# Altium project TestBoard_01.PrjPcb
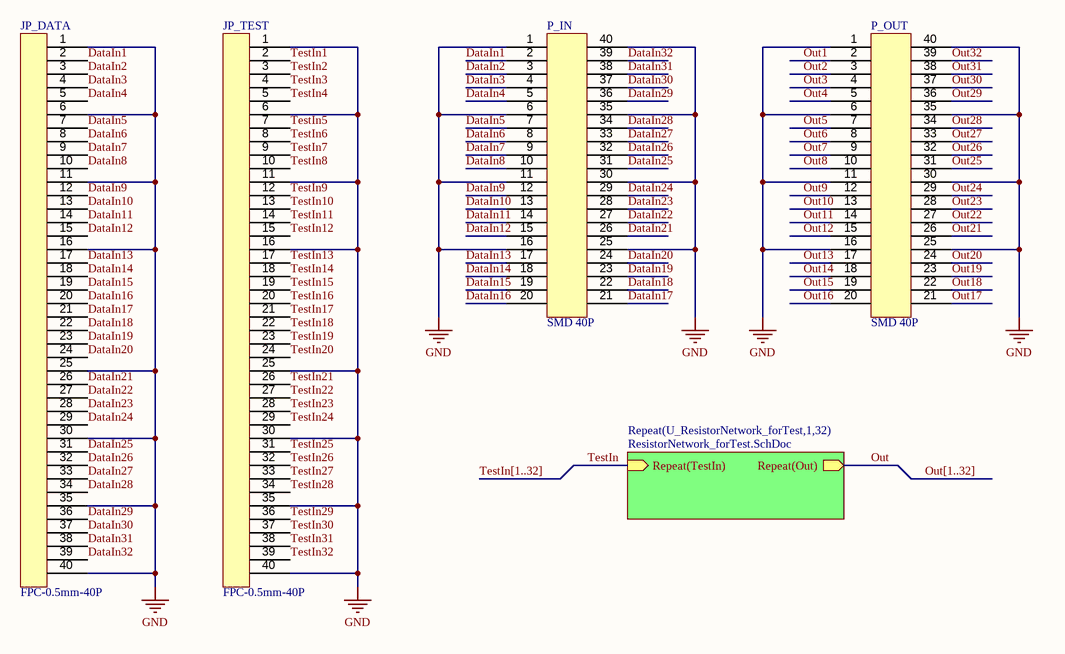
[diagram p0: TestBoard.SchDoc]
Version: 1.1 (TO); RepoURL: https://github.com/hkust-fiona/fiona-hardware.git; Project: FIONA Toolchain (Test Board #01); License: Light the Way Forward; Author: Yinyi (Shannon) LIU
2 sheets, 100 parts. Net scope: hierarchical (ports join the sheet entries above them; power ports are global).
Board file: PCB_TestBoard.PcbDoc
Sheets:
  TestBoard.SchDoc
    U_ResistorNetwork_forTest1 = ResistorNetwork_forTest.SchDoc
    U_ResistorNetwork_forTest2 = ResistorNetwork_forTest.SchDoc
    U_ResistorNetwork_forTest3 = ResistorNetwork_forTest.SchDoc
    U_ResistorNetwork_forTest4 = ResistorNetwork_forTest.SchDoc
    U_ResistorNetwork_forTest5 = ResistorNetwork_forTest.SchDoc
    U_ResistorNetwork_forTest6 = ResistorNetwork_forTest.SchDoc
    U_ResistorNetwork_forTest7 = ResistorNetwork_forTest.SchDoc
    U_ResistorNetwork_forTest8 = ResistorNetwork_forTest.SchDoc
    U_ResistorNetwork_forTest9 = ResistorNetwork_forTest.SchDoc
    U_ResistorNetwork_forTest10 = ResistorNetwork_forTest.SchDoc
    U_ResistorNetwork_forTest11 = ResistorNetwork_forTest.SchDoc
    U_ResistorNetwork_forTest12 = ResistorNetwork_forTest.SchDoc
    U_ResistorNetwork_forTest13 = ResistorNetwork_forTest.SchDoc
    U_ResistorNetwork_forTest14 = ResistorNetwork_forTest.SchDoc
    U_ResistorNetwork_forTest15 = ResistorNetwork_forTest.SchDoc
    U_ResistorNetwork_forTest16 = ResistorNetwork_forTest.SchDoc
    U_ResistorNetwork_forTest17 = ResistorNetwork_forTest.SchDoc
    U_ResistorNetwork_forTest18 = ResistorNetwork_forTest.SchDoc
    U_ResistorNetwork_forTest19 = ResistorNetwork_forTest.SchDoc
    U_ResistorNetwork_forTest20 = ResistorNetwork_forTest.SchDoc
    U_ResistorNetwork_forTest21 = ResistorNetwork_forTest.SchDoc
    U_ResistorNetwork_forTest22 = ResistorNetwork_forTest.SchDoc
    U_ResistorNetwork_forTest23 = ResistorNetwork_forTest.SchDoc
    U_ResistorNetwork_forTest24 = ResistorNetwork_forTest.SchDoc
    U_ResistorNetwork_forTest25 = ResistorNetwork_forTest.SchDoc
    U_ResistorNetwork_forTest26 = ResistorNetwork_forTest.SchDoc
    U_ResistorNetwork_forTest27 = ResistorNetwork_forTest.SchDoc
    U_ResistorNetwork_forTest28 = ResistorNetwork_forTest.SchDoc
    U_ResistorNetwork_forTest29 = ResistorNetwork_forTest.SchDoc
    U_ResistorNetwork_forTest30 = ResistorNetwork_forTest.SchDoc
    U_ResistorNetwork_forTest31 = ResistorNetwork_forTest.SchDoc
    U_ResistorNetwork_forTest32 = ResistorNetwork_forTest.SchDoc

## Sheet TestBoard.SchDoc: Tray Board for Photonic Chip
size A4; Date: Mar 22, 2023; Author: Yinyi (Shannon) LIU; SheetNumber: 1; SheetTotal: 2

### Parts
JP_DATA  FPC-0.5mm-40P  [FPC0.5 2H-WS-40P]
JP_TEST  FPC-0.5mm-40P  [FPC0.5 2H-WS-40P]
P_IN  SMD 40P  [SMD-40P-W0.2-H0.6-T0.4]
P_OUT  SMD 40P  [SMD-40P-W0.2-H0.6-T0.4]

### Sub-sheets
Repeat(U_ResistorNetwork_forTest,1,32) = ResistorNetwork_forTest.SchDoc: Repeat(TestIn) (in), Repeat(Out) (out)

### Nets
GND: JP_DATA.1 JP_DATA.6 JP_DATA.11 JP_DATA.16 JP_DATA.25 JP_DATA.30 JP_DATA.35 JP_DATA.40 JP_TEST.1 JP_TEST.6 JP_TEST.11 JP_TEST.16 JP_TEST.25 JP_TEST.30 JP_TEST.35 JP_TEST.40 P_IN.1 P_IN.6 P_IN.11 P_IN.16 P_IN.25 P_IN.30 P_IN.35 P_IN.40 P_OUT.1 P_OUT.6 P_OUT.11 P_OUT.16 P_OUT.25 P_OUT.30 P_OUT.35 P_OUT.40
DataIn1: JP_DATA.2 P_IN.2
DataIn2: JP_DATA.3 P_IN.3
DataIn3: JP_DATA.4 P_IN.4
DataIn4: JP_DATA.5 P_IN.5
DataIn5: JP_DATA.7 P_IN.7
DataIn6: JP_DATA.8 P_IN.8
DataIn7: JP_DATA.9 P_IN.9
DataIn8: JP_DATA.10 P_IN.10
DataIn9: JP_DATA.12 P_IN.12
DataIn10: JP_DATA.13 P_IN.13
DataIn11: JP_DATA.14 P_IN.14
DataIn12: JP_DATA.15 P_IN.15
DataIn13: JP_DATA.17 P_IN.17
DataIn14: JP_DATA.18 P_IN.18
DataIn15: JP_DATA.19 P_IN.19
DataIn16: JP_DATA.20 P_IN.20
DataIn17: JP_DATA.21 P_IN.21
DataIn18: JP_DATA.22 P_IN.22
DataIn19: JP_DATA.23 P_IN.23
DataIn20: JP_DATA.24 P_IN.24
DataIn21: JP_DATA.26 P_IN.26
DataIn22: JP_DATA.27 P_IN.27
DataIn23: JP_DATA.28 P_IN.28
DataIn24: JP_DATA.29 P_IN.29
DataIn25: JP_DATA.31 P_IN.31
DataIn26: JP_DATA.32 P_IN.32
DataIn27: JP_DATA.33 P_IN.33
DataIn28: JP_DATA.34 P_IN.34
DataIn29: JP_DATA.36 P_IN.36
DataIn30: JP_DATA.37 P_IN.37
DataIn31: JP_DATA.38 P_IN.38
DataIn32: JP_DATA.39 P_IN.39
Out: sheet Repeat(U_ResistorNetwork_forTest,1,32)/Repeat(Out)
Out1: P_OUT.2
Out2: P_OUT.3
Out3: P_OUT.4
Out4: P_OUT.5
Out5: P_OUT.7
Out6: P_OUT.8
Out7: P_OUT.9
Out8: P_OUT.10
Out9: P_OUT.12
Out10: P_OUT.13
Out11: P_OUT.14
Out12: P_OUT.15
Out13: P_OUT.17
Out14: P_OUT.18
Out15: P_OUT.19
Out16: P_OUT.20
Out17: P_OUT.21
Out18: P_OUT.22
Out19: P_OUT.23
Out20: P_OUT.24
Out21: P_OUT.26
Out22: P_OUT.27
Out23: P_OUT.28
Out24: P_OUT.29
Out25: P_OUT.31
Out26: P_OUT.32
Out27: P_OUT.33
Out28: P_OUT.34
Out29: P_OUT.36
Out30: P_OUT.37
Out31: P_OUT.38
Out32: P_OUT.39
TestIn: sheet Repeat(U_ResistorNetwork_forTest,1,32)/Repeat(TestIn)
TestIn1: JP_TEST.2
TestIn2: JP_TEST.3
TestIn3: JP_TEST.4
TestIn4: JP_TEST.5
TestIn5: JP_TEST.7
TestIn6: JP_TEST.8
TestIn7: JP_TEST.9
TestIn8: JP_TEST.10
TestIn9: JP_TEST.12
TestIn10: JP_TEST.13
TestIn11: JP_TEST.14
TestIn12: JP_TEST.15
TestIn13: JP_TEST.17
TestIn14: JP_TEST.18
TestIn15: JP_TEST.19
TestIn16: JP_TEST.20
TestIn17: JP_TEST.21
TestIn18: JP_TEST.22
TestIn19: JP_TEST.23
TestIn20: JP_TEST.24
TestIn21: JP_TEST.26
TestIn22: JP_TEST.27
TestIn23: JP_TEST.28
TestIn24: JP_TEST.29
TestIn25: JP_TEST.31
TestIn26: JP_TEST.32
TestIn27: JP_TEST.33
TestIn28: JP_TEST.34
TestIn29: JP_TEST.36
TestIn30: JP_TEST.37
TestIn31: JP_TEST.38
TestIn32: JP_TEST.39

### Buses and harness runs
bus Out[1..32]
bus TestIn[1..32]

### Notes on the sheet
- Title
- FileName:
- Version:
- Date:
- Project
- Designed By:
- Descriptions:
- Sheet:
- of

### Library data of the parts
JP_DATA JP_TEST = FPC-0.5mm-40P: FPC Connector 0.5mm 40PIN
P_IN P_OUT = SMD 40P: SMD Pad for Chip Bonding (40 PIN).

## Sheet ResistorNetwork_forTest.SchDoc: Resistor Network as Voltage Divider for Testing
size A4; Date: Mar 22, 2023; SheetNumber: 2; SheetTotal: 2
Used 32 times, as channels U_ResistorNetwork_forTest1, U_ResistorNetwork_forTest2, U_ResistorNetwork_forTest3, U_ResistorNetwork_forTest4, U_ResistorNetwork_forTest5, U_ResistorNetwork_forTest6, U_ResistorNetwork_forTest7, U_ResistorNetwork_forTest8, U_ResistorNetwork_forTest9, U_ResistorNetwork_forTest10, U_ResistorNetwork_forTest11, U_ResistorNetwork_forTest12, U_ResistorNetwork_forTest13, U_ResistorNetwork_forTest14, U_ResistorNetwork_forTest15, U_ResistorNetwork_forTest16, U_ResistorNetwork_forTest17, U_ResistorNetwork_forTest18, U_ResistorNetwork_forTest19, U_ResistorNetwork_forTest20, U_ResistorNetwork_forTest21, U_ResistorNetwork_forTest22, U_ResistorNetwork_forTest23, U_ResistorNetwork_forTest24, U_ResistorNetwork_forTest25, U_ResistorNetwork_forTest26, U_ResistorNetwork_forTest27, U_ResistorNetwork_forTest28, U_ResistorNetwork_forTest29, U_ResistorNetwork_forTest30, U_ResistorNetwork_forTest31, U_ResistorNetwork_forTest32. Parts and nets are listed once, with the designators drawn on the sheet.
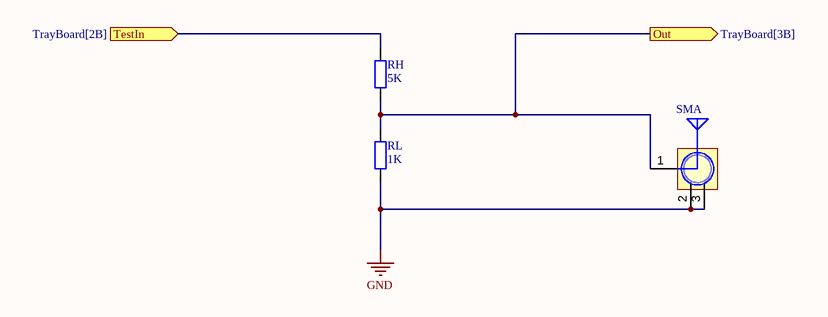
[diagram p1: ResistorNetwork_forTest.SchDoc]

### Parts
RH  5K  [R 0402_L]
RL  1K  [R 0402_L]
SMA  SMA RF 立式  [SMA-KE-LI]  (value not drawn)

### Ports
Out (out, see TrayBoard[3B]), TestIn (in, see TrayBoard[2B])

### Nets
GND: RL.1 SMA.2(GND) SMA.3(GND)
Out: RH.1 RL.2 SMA.1(ANT) ; port Out
TestIn: RH.2 ; port TestIn

### Channels
U_ResistorNetwork_forTest1: designators end in _U_ResistorNetwork_forTest1; ports Out=Out1 TestIn=TestIn1
U_ResistorNetwork_forTest2: designators end in _U_ResistorNetwork_forTest2; ports Out=Out2 TestIn=TestIn2
U_ResistorNetwork_forTest3: designators end in _U_ResistorNetwork_forTest3; ports Out=Out3 TestIn=TestIn3
U_ResistorNetwork_forTest4: designators end in _U_ResistorNetwork_forTest4; ports Out=Out4 TestIn=TestIn4
U_ResistorNetwork_forTest5: designators end in _U_ResistorNetwork_forTest5; ports Out=Out5 TestIn=TestIn5
U_ResistorNetwork_forTest6: designators end in _U_ResistorNetwork_forTest6; ports Out=Out6 TestIn=TestIn6
U_ResistorNetwork_forTest7: designators end in _U_ResistorNetwork_forTest7; ports Out=Out7 TestIn=TestIn7
U_ResistorNetwork_forTest8: designators end in _U_ResistorNetwork_forTest8; ports Out=Out8 TestIn=TestIn8
U_ResistorNetwork_forTest9: designators end in _U_ResistorNetwork_forTest9; ports Out=Out9 TestIn=TestIn9
U_ResistorNetwork_forTest10: designators end in _U_ResistorNetwork_forTest10; ports Out=Out10 TestIn=TestIn10
U_ResistorNetwork_forTest11: designators end in _U_ResistorNetwork_forTest11; ports Out=Out11 TestIn=TestIn11
U_ResistorNetwork_forTest12: designators end in _U_ResistorNetwork_forTest12; ports Out=Out12 TestIn=TestIn12
U_ResistorNetwork_forTest13: designators end in _U_ResistorNetwork_forTest13; ports Out=Out13 TestIn=TestIn13
U_ResistorNetwork_forTest14: designators end in _U_ResistorNetwork_forTest14; ports Out=Out14 TestIn=TestIn14
U_ResistorNetwork_forTest15: designators end in _U_ResistorNetwork_forTest15; ports Out=Out15 TestIn=TestIn15
U_ResistorNetwork_forTest16: designators end in _U_ResistorNetwork_forTest16; ports Out=Out16 TestIn=TestIn16
U_ResistorNetwork_forTest17: designators end in _U_ResistorNetwork_forTest17; ports Out=Out17 TestIn=TestIn17
U_ResistorNetwork_forTest18: designators end in _U_ResistorNetwork_forTest18; ports Out=Out18 TestIn=TestIn18
U_ResistorNetwork_forTest19: designators end in _U_ResistorNetwork_forTest19; ports Out=Out19 TestIn=TestIn19
U_ResistorNetwork_forTest20: designators end in _U_ResistorNetwork_forTest20; ports Out=Out20 TestIn=TestIn20
U_ResistorNetwork_forTest21: designators end in _U_ResistorNetwork_forTest21; ports Out=Out21 TestIn=TestIn21
U_ResistorNetwork_forTest22: designators end in _U_ResistorNetwork_forTest22; ports Out=Out22 TestIn=TestIn22
U_ResistorNetwork_forTest23: designators end in _U_ResistorNetwork_forTest23; ports Out=Out23 TestIn=TestIn23
U_ResistorNetwork_forTest24: designators end in _U_ResistorNetwork_forTest24; ports Out=Out24 TestIn=TestIn24
U_ResistorNetwork_forTest25: designators end in _U_ResistorNetwork_forTest25; ports Out=Out25 TestIn=TestIn25
U_ResistorNetwork_forTest26: designators end in _U_ResistorNetwork_forTest26; ports Out=Out26 TestIn=TestIn26
U_ResistorNetwork_forTest27: designators end in _U_ResistorNetwork_forTest27; ports Out=Out27 TestIn=TestIn27
U_ResistorNetwork_forTest28: designators end in _U_ResistorNetwork_forTest28; ports Out=Out28 TestIn=TestIn28
U_ResistorNetwork_forTest29: designators end in _U_ResistorNetwork_forTest29; ports Out=Out29 TestIn=TestIn29
U_ResistorNetwork_forTest30: designators end in _U_ResistorNetwork_forTest30; ports Out=Out30 TestIn=TestIn30
U_ResistorNetwork_forTest31: designators end in _U_ResistorNetwork_forTest31; ports Out=Out31 TestIn=TestIn31
U_ResistorNetwork_forTest32: designators end in _U_ResistorNetwork_forTest32; ports Out=Out32 TestIn=TestIn32

### Notes on the sheet
- Title
- FileName:
- Version:
- Date:
- Project
- Designed By:
- Descriptions:
- Sheet:
- of

### Library data of the parts
RH = R: 贴片电阻 0.1% / C3202451; 版权归属: 来自淘宝 ID：黄晶宝石; 封装库来自淘宝卖家 ID：黄晶宝石: 其他店铺购入均为盗版，不享受售后技术支持服务，请立即申请退款; BOM名称: 贴片电阻; 联系售后: https://shop463601444.taobao.com
RL = R: 贴片电阻 0.1%; 版权归属: 来自淘宝 ID：黄晶宝石; 封装库来自淘宝卖家 ID：黄晶宝石: 其他店铺购入均为盗版，不享受售后技术支持服务，请立即申请退款; BOM名称: 贴片电阻; 联系售后: https://shop463601444.taobao.com
SMA = SMA: BOM名称: SMA-2.4G射频天线接口; 版权归属: 封装库来自淘宝 ID：黄晶宝石; 唯一出售店铺网址: https://shop463601444.taobao.com

## Nets that join several sheets
GND: TestBoard (32 pins), U_ResistorNetwork_forTest1 (RL_U_ResistorNetwork_forTest1.1 SMA_U_ResistorNetwork_forTest1.2 SMA_U_ResistorNetwork_forTest1.3), U_ResistorNetwork_forTest2 (RL_U_ResistorNetwork_forTest2.1 SMA_U_ResistorNetwork_forTest2.2 SMA_U_ResistorNetwork_forTest2.3), U_ResistorNetwork_forTest3 (RL_U_ResistorNetwork_forTest3.1 SMA_U_ResistorNetwork_forTest3.2 SMA_U_ResistorNetwork_forTest3.3), U_ResistorNetwork_forTest4 (RL_U_ResistorNetwork_forTest4.1 SMA_U_ResistorNetwork_forTest4.2 SMA_U_ResistorNetwork_forTest4.3), U_ResistorNetwork_forTest5 (RL_U_ResistorNetwork_forTest5.1 SMA_U_ResistorNetwork_forTest5.2 SMA_U_ResistorNetwork_forTest5.3), U_ResistorNetwork_forTest6 (RL_U_ResistorNetwork_forTest6.1 SMA_U_ResistorNetwork_forTest6.2 SMA_U_ResistorNetwork_forTest6.3), U_ResistorNetwork_forTest7 (RL_U_ResistorNetwork_forTest7.1 SMA_U_ResistorNetwork_forTest7.2 SMA_U_ResistorNetwork_forTest7.3), U_ResistorNetwork_forTest8 (RL_U_ResistorNetwork_forTest8.1 SMA_U_ResistorNetwork_forTest8.2 SMA_U_ResistorNetwork_forTest8.3), U_ResistorNetwork_forTest9 (RL_U_ResistorNetwork_forTest9.1 SMA_U_ResistorNetwork_forTest9.2 SMA_U_ResistorNetwork_forTest9.3), U_ResistorNetwork_forTest10 (RL_U_ResistorNetwork_forTest10.1 SMA_U_ResistorNetwork_forTest10.2 SMA_U_ResistorNetwork_forTest10.3), U_ResistorNetwork_forTest11 (RL_U_ResistorNetwork_forTest11.1 SMA_U_ResistorNetwork_forTest11.2 SMA_U_ResistorNetwork_forTest11.3), U_ResistorNetwork_forTest12 (RL_U_ResistorNetwork_forTest12.1 SMA_U_ResistorNetwork_forTest12.2 SMA_U_ResistorNetwork_forTest12.3), U_ResistorNetwork_forTest13 (RL_U_ResistorNetwork_forTest13.1 SMA_U_ResistorNetwork_forTest13.2 SMA_U_ResistorNetwork_forTest13.3), U_ResistorNetwork_forTest14 (RL_U_ResistorNetwork_forTest14.1 SMA_U_ResistorNetwork_forTest14.2 SMA_U_ResistorNetwork_forTest14.3), U_ResistorNetwork_forTest15 (RL_U_ResistorNetwork_forTest15.1 SMA_U_ResistorNetwork_forTest15.2 SMA_U_ResistorNetwork_forTest15.3), U_ResistorNetwork_forTest16 (RL_U_ResistorNetwork_forTest16.1 SMA_U_ResistorNetwork_forTest16.2 SMA_U_ResistorNetwork_forTest16.3), U_ResistorNetwork_forTest17 (RL_U_ResistorNetwork_forTest17.1 SMA_U_ResistorNetwork_forTest17.2 SMA_U_ResistorNetwork_forTest17.3), U_ResistorNetwork_forTest18 (RL_U_ResistorNetwork_forTest18.1 SMA_U_ResistorNetwork_forTest18.2 SMA_U_ResistorNetwork_forTest18.3), U_ResistorNetwork_forTest19 (RL_U_ResistorNetwork_forTest19.1 SMA_U_ResistorNetwork_forTest19.2 SMA_U_ResistorNetwork_forTest19.3), U_ResistorNetwork_forTest20 (RL_U_ResistorNetwork_forTest20.1 SMA_U_ResistorNetwork_forTest20.2 SMA_U_ResistorNetwork_forTest20.3), U_ResistorNetwork_forTest21 (RL_U_ResistorNetwork_forTest21.1 SMA_U_ResistorNetwork_forTest21.2 SMA_U_ResistorNetwork_forTest21.3), U_ResistorNetwork_forTest22 (RL_U_ResistorNetwork_forTest22.1 SMA_U_ResistorNetwork_forTest22.2 SMA_U_ResistorNetwork_forTest22.3), U_ResistorNetwork_forTest23 (RL_U_ResistorNetwork_forTest23.1 SMA_U_ResistorNetwork_forTest23.2 SMA_U_ResistorNetwork_forTest23.3), U_ResistorNetwork_forTest24 (RL_U_ResistorNetwork_forTest24.1 SMA_U_ResistorNetwork_forTest24.2 SMA_U_ResistorNetwork_forTest24.3), U_ResistorNetwork_forTest25 (RL_U_ResistorNetwork_forTest25.1 SMA_U_ResistorNetwork_forTest25.2 SMA_U_ResistorNetwork_forTest25.3), U_ResistorNetwork_forTest26 (RL_U_ResistorNetwork_forTest26.1 SMA_U_ResistorNetwork_forTest26.2 SMA_U_ResistorNetwork_forTest26.3), U_ResistorNetwork_forTest27 (RL_U_ResistorNetwork_forTest27.1 SMA_U_ResistorNetwork_forTest27.2 SMA_U_ResistorNetwork_forTest27.3), U_ResistorNetwork_forTest28 (RL_U_ResistorNetwork_forTest28.1 SMA_U_ResistorNetwork_forTest28.2 SMA_U_ResistorNetwork_forTest28.3), U_ResistorNetwork_forTest29 (RL_U_ResistorNetwork_forTest29.1 SMA_U_ResistorNetwork_forTest29.2 SMA_U_ResistorNetwork_forTest29.3), U_ResistorNetwork_forTest30 (RL_U_ResistorNetwork_forTest30.1 SMA_U_ResistorNetwork_forTest30.2 SMA_U_ResistorNetwork_forTest30.3), U_ResistorNetwork_forTest31 (RL_U_ResistorNetwork_forTest31.1 SMA_U_ResistorNetwork_forTest31.2 SMA_U_ResistorNetwork_forTest31.3), U_ResistorNetwork_forTest32 (RL_U_ResistorNetwork_forTest32.1 SMA_U_ResistorNetwork_forTest32.2 SMA_U_ResistorNetwork_forTest32.3)
Out1: TestBoard (P_OUT.2), U_ResistorNetwork_forTest1 (RH_U_ResistorNetwork_forTest1.1 RL_U_ResistorNetwork_forTest1.2 SMA_U_ResistorNetwork_forTest1.1)
Out2: TestBoard (P_OUT.3), U_ResistorNetwork_forTest2 (RH_U_ResistorNetwork_forTest2.1 RL_U_ResistorNetwork_forTest2.2 SMA_U_ResistorNetwork_forTest2.1)
Out3: TestBoard (P_OUT.4), U_ResistorNetwork_forTest3 (RH_U_ResistorNetwork_forTest3.1 RL_U_ResistorNetwork_forTest3.2 SMA_U_ResistorNetwork_forTest3.1)
Out4: TestBoard (P_OUT.5), U_ResistorNetwork_forTest4 (RH_U_ResistorNetwork_forTest4.1 RL_U_ResistorNetwork_forTest4.2 SMA_U_ResistorNetwork_forTest4.1)
Out5: TestBoard (P_OUT.7), U_ResistorNetwork_forTest5 (RH_U_ResistorNetwork_forTest5.1 RL_U_ResistorNetwork_forTest5.2 SMA_U_ResistorNetwork_forTest5.1)
Out6: TestBoard (P_OUT.8), U_ResistorNetwork_forTest6 (RH_U_ResistorNetwork_forTest6.1 RL_U_ResistorNetwork_forTest6.2 SMA_U_ResistorNetwork_forTest6.1)
Out7: TestBoard (P_OUT.9), U_ResistorNetwork_forTest7 (RH_U_ResistorNetwork_forTest7.1 RL_U_ResistorNetwork_forTest7.2 SMA_U_ResistorNetwork_forTest7.1)
Out8: TestBoard (P_OUT.10), U_ResistorNetwork_forTest8 (RH_U_ResistorNetwork_forTest8.1 RL_U_ResistorNetwork_forTest8.2 SMA_U_ResistorNetwork_forTest8.1)
Out9: TestBoard (P_OUT.12), U_ResistorNetwork_forTest9 (RH_U_ResistorNetwork_forTest9.1 RL_U_ResistorNetwork_forTest9.2 SMA_U_ResistorNetwork_forTest9.1)
Out10: TestBoard (P_OUT.13), U_ResistorNetwork_forTest10 (RH_U_ResistorNetwork_forTest10.1 RL_U_ResistorNetwork_forTest10.2 SMA_U_ResistorNetwork_forTest10.1)
Out11: TestBoard (P_OUT.14), U_ResistorNetwork_forTest11 (RH_U_ResistorNetwork_forTest11.1 RL_U_ResistorNetwork_forTest11.2 SMA_U_ResistorNetwork_forTest11.1)
Out12: TestBoard (P_OUT.15), U_ResistorNetwork_forTest12 (RH_U_ResistorNetwork_forTest12.1 RL_U_ResistorNetwork_forTest12.2 SMA_U_ResistorNetwork_forTest12.1)
Out13: TestBoard (P_OUT.17), U_ResistorNetwork_forTest13 (RH_U_ResistorNetwork_forTest13.1 RL_U_ResistorNetwork_forTest13.2 SMA_U_ResistorNetwork_forTest13.1)
Out14: TestBoard (P_OUT.18), U_ResistorNetwork_forTest14 (RH_U_ResistorNetwork_forTest14.1 RL_U_ResistorNetwork_forTest14.2 SMA_U_ResistorNetwork_forTest14.1)
Out15: TestBoard (P_OUT.19), U_ResistorNetwork_forTest15 (RH_U_ResistorNetwork_forTest15.1 RL_U_ResistorNetwork_forTest15.2 SMA_U_ResistorNetwork_forTest15.1)
Out16: TestBoard (P_OUT.20), U_ResistorNetwork_forTest16 (RH_U_ResistorNetwork_forTest16.1 RL_U_ResistorNetwork_forTest16.2 SMA_U_ResistorNetwork_forTest16.1)
Out17: TestBoard (P_OUT.21), U_ResistorNetwork_forTest17 (RH_U_ResistorNetwork_forTest17.1 RL_U_ResistorNetwork_forTest17.2 SMA_U_ResistorNetwork_forTest17.1)
Out18: TestBoard (P_OUT.22), U_ResistorNetwork_forTest18 (RH_U_ResistorNetwork_forTest18.1 RL_U_ResistorNetwork_forTest18.2 SMA_U_ResistorNetwork_forTest18.1)
Out19: TestBoard (P_OUT.23), U_ResistorNetwork_forTest19 (RH_U_ResistorNetwork_forTest19.1 RL_U_ResistorNetwork_forTest19.2 SMA_U_ResistorNetwork_forTest19.1)
Out20: TestBoard (P_OUT.24), U_ResistorNetwork_forTest20 (RH_U_ResistorNetwork_forTest20.1 RL_U_ResistorNetwork_forTest20.2 SMA_U_ResistorNetwork_forTest20.1)
Out21: TestBoard (P_OUT.26), U_ResistorNetwork_forTest21 (RH_U_ResistorNetwork_forTest21.1 RL_U_ResistorNetwork_forTest21.2 SMA_U_ResistorNetwork_forTest21.1)
Out22: TestBoard (P_OUT.27), U_ResistorNetwork_forTest22 (RH_U_ResistorNetwork_forTest22.1 RL_U_ResistorNetwork_forTest22.2 SMA_U_ResistorNetwork_forTest22.1)
Out23: TestBoard (P_OUT.28), U_ResistorNetwork_forTest23 (RH_U_ResistorNetwork_forTest23.1 RL_U_ResistorNetwork_forTest23.2 SMA_U_ResistorNetwork_forTest23.1)
Out24: TestBoard (P_OUT.29), U_ResistorNetwork_forTest24 (RH_U_ResistorNetwork_forTest24.1 RL_U_ResistorNetwork_forTest24.2 SMA_U_ResistorNetwork_forTest24.1)
Out25: TestBoard (P_OUT.31), U_ResistorNetwork_forTest25 (RH_U_ResistorNetwork_forTest25.1 RL_U_ResistorNetwork_forTest25.2 SMA_U_ResistorNetwork_forTest25.1)
Out26: TestBoard (P_OUT.32), U_ResistorNetwork_forTest26 (RH_U_ResistorNetwork_forTest26.1 RL_U_ResistorNetwork_forTest26.2 SMA_U_ResistorNetwork_forTest26.1)
Out27: TestBoard (P_OUT.33), U_ResistorNetwork_forTest27 (RH_U_ResistorNetwork_forTest27.1 RL_U_ResistorNetwork_forTest27.2 SMA_U_ResistorNetwork_forTest27.1)
Out28: TestBoard (P_OUT.34), U_ResistorNetwork_forTest28 (RH_U_ResistorNetwork_forTest28.1 RL_U_ResistorNetwork_forTest28.2 SMA_U_ResistorNetwork_forTest28.1)
Out29: TestBoard (P_OUT.36), U_ResistorNetwork_forTest29 (RH_U_ResistorNetwork_forTest29.1 RL_U_ResistorNetwork_forTest29.2 SMA_U_ResistorNetwork_forTest29.1)
Out30: TestBoard (P_OUT.37), U_ResistorNetwork_forTest30 (RH_U_ResistorNetwork_forTest30.1 RL_U_ResistorNetwork_forTest30.2 SMA_U_ResistorNetwork_forTest30.1)
Out31: TestBoard (P_OUT.38), U_ResistorNetwork_forTest31 (RH_U_ResistorNetwork_forTest31.1 RL_U_ResistorNetwork_forTest31.2 SMA_U_ResistorNetwork_forTest31.1)
Out32: TestBoard (P_OUT.39), U_ResistorNetwork_forTest32 (RH_U_ResistorNetwork_forTest32.1 RL_U_ResistorNetwork_forTest32.2 SMA_U_ResistorNetwork_forTest32.1)
TestIn1: TestBoard (JP_TEST.2), U_ResistorNetwork_forTest1 (RH_U_ResistorNetwork_forTest1.2)
TestIn2: TestBoard (JP_TEST.3), U_ResistorNetwork_forTest2 (RH_U_ResistorNetwork_forTest2.2)
TestIn3: TestBoard (JP_TEST.4), U_ResistorNetwork_forTest3 (RH_U_ResistorNetwork_forTest3.2)
TestIn4: TestBoard (JP_TEST.5), U_ResistorNetwork_forTest4 (RH_U_ResistorNetwork_forTest4.2)
TestIn5: TestBoard (JP_TEST.7), U_ResistorNetwork_forTest5 (RH_U_ResistorNetwork_forTest5.2)
TestIn6: TestBoard (JP_TEST.8), U_ResistorNetwork_forTest6 (RH_U_ResistorNetwork_forTest6.2)
TestIn7: TestBoard (JP_TEST.9), U_ResistorNetwork_forTest7 (RH_U_ResistorNetwork_forTest7.2)
TestIn8: TestBoard (JP_TEST.10), U_ResistorNetwork_forTest8 (RH_U_ResistorNetwork_forTest8.2)
TestIn9: TestBoard (JP_TEST.12), U_ResistorNetwork_forTest9 (RH_U_ResistorNetwork_forTest9.2)
TestIn10: TestBoard (JP_TEST.13), U_ResistorNetwork_forTest10 (RH_U_ResistorNetwork_forTest10.2)
TestIn11: TestBoard (JP_TEST.14), U_ResistorNetwork_forTest11 (RH_U_ResistorNetwork_forTest11.2)
TestIn12: TestBoard (JP_TEST.15), U_ResistorNetwork_forTest12 (RH_U_ResistorNetwork_forTest12.2)
TestIn13: TestBoard (JP_TEST.17), U_ResistorNetwork_forTest13 (RH_U_ResistorNetwork_forTest13.2)
TestIn14: TestBoard (JP_TEST.18), U_ResistorNetwork_forTest14 (RH_U_ResistorNetwork_forTest14.2)
TestIn15: TestBoard (JP_TEST.19), U_ResistorNetwork_forTest15 (RH_U_ResistorNetwork_forTest15.2)
TestIn16: TestBoard (JP_TEST.20), U_ResistorNetwork_forTest16 (RH_U_ResistorNetwork_forTest16.2)
TestIn17: TestBoard (JP_TEST.21), U_ResistorNetwork_forTest17 (RH_U_ResistorNetwork_forTest17.2)
TestIn18: TestBoard (JP_TEST.22), U_ResistorNetwork_forTest18 (RH_U_ResistorNetwork_forTest18.2)
TestIn19: TestBoard (JP_TEST.23), U_ResistorNetwork_forTest19 (RH_U_ResistorNetwork_forTest19.2)
TestIn20: TestBoard (JP_TEST.24), U_ResistorNetwork_forTest20 (RH_U_ResistorNetwork_forTest20.2)
TestIn21: TestBoard (JP_TEST.26), U_ResistorNetwork_forTest21 (RH_U_ResistorNetwork_forTest21.2)
TestIn22: TestBoard (JP_TEST.27), U_ResistorNetwork_forTest22 (RH_U_ResistorNetwork_forTest22.2)
TestIn23: TestBoard (JP_TEST.28), U_ResistorNetwork_forTest23 (RH_U_ResistorNetwork_forTest23.2)
TestIn24: TestBoard (JP_TEST.29), U_ResistorNetwork_forTest24 (RH_U_ResistorNetwork_forTest24.2)
TestIn25: TestBoard (JP_TEST.31), U_ResistorNetwork_forTest25 (RH_U_ResistorNetwork_forTest25.2)
TestIn26: TestBoard (JP_TEST.32), U_ResistorNetwork_forTest26 (RH_U_ResistorNetwork_forTest26.2)
TestIn27: TestBoard (JP_TEST.33), U_ResistorNetwork_forTest27 (RH_U_ResistorNetwork_forTest27.2)
TestIn28: TestBoard (JP_TEST.34), U_ResistorNetwork_forTest28 (RH_U_ResistorNetwork_forTest28.2)
TestIn29: TestBoard (JP_TEST.36), U_ResistorNetwork_forTest29 (RH_U_ResistorNetwork_forTest29.2)
TestIn30: TestBoard (JP_TEST.37), U_ResistorNetwork_forTest30 (RH_U_ResistorNetwork_forTest30.2)
TestIn31: TestBoard (JP_TEST.38), U_ResistorNetwork_forTest31 (RH_U_ResistorNetwork_forTest31.2)
TestIn32: TestBoard (JP_TEST.39), U_ResistorNetwork_forTest32 (RH_U_ResistorNetwork_forTest32.2)